# Altium project USBC_Power_Supply.PrjPcb (part 1 of 2)
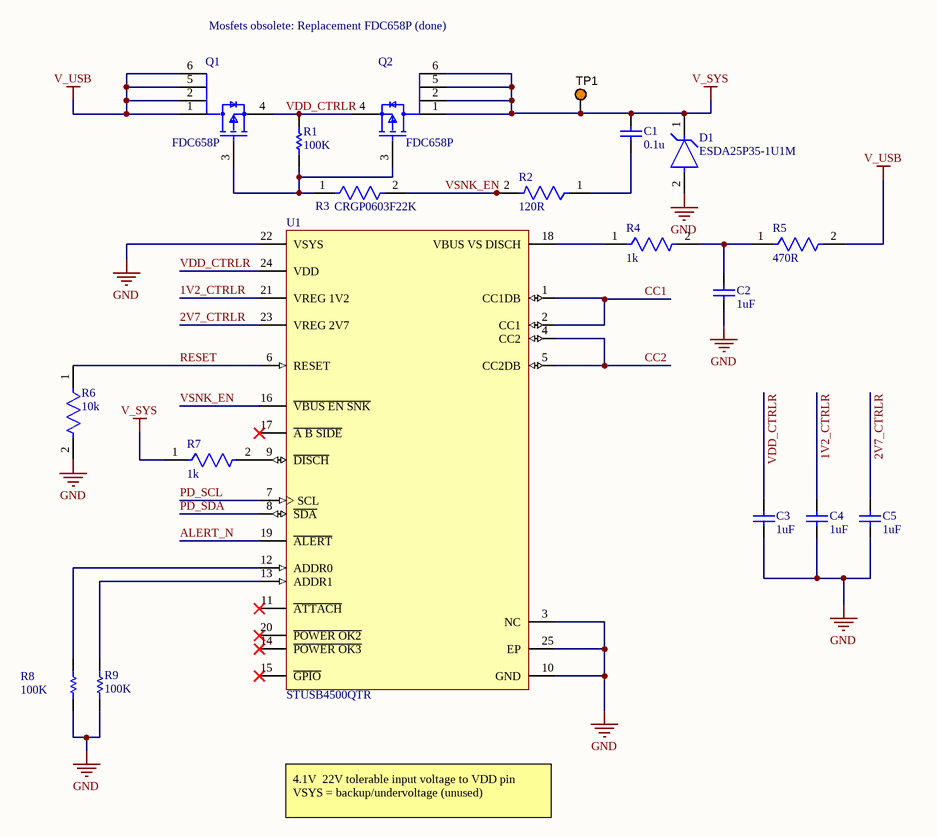
[diagram p0: USBC_PD_Controller.SchDoc]
8 sheets, 169 parts. Net scope: global (net labels, ports and power ports of the same name join across sheets).
Board file: USBC_PD_Development_PCB.PcbDoc
Sheets:
  USBC_PD_Controller.SchDoc
  USB_C_Connectors.SchDoc
  MCU.SchDoc
  Positive_Output.SchDoc
  Negative_Output.SchDoc
  Logic_Level_Output.SchDoc
  External_Connectors.SchDoc
  Measurements.SchDoc

## Sheet USBC_PD_Controller.SchDoc
size A; SheetNumber: 1; SheetTotal: 8

### Parts
C1  0.1u  [CAPC2013X140X50ML20T25]
C2  1uF  [CAPC2013X145X50NL20T20]
C3  1uF  [CAPC2013X145X50NL20T20]
C4  1uF  [CAPC2013X145X50NL20T20]
C5  1uF  [CAPC2013X145X50NL20T20]
D1  ESDA25P35-1U1M  [FP-QFN_1610-MFG]
Q1  FDC658P  [FP-419BL-MFG]
Q2  FDC658P  [FP-419BL-MFG]
R1  100K  [RESC0603(1608)_N]
R2  120R  [FP-SR0603-MFG]
R3  CRGP0603F22K  [FP-CRGP0603-IPC_C]
R4  1k  [FP-MCT0603-IPC_C]
R5  470R  [FP-CRCW0603-HPe3-MFG]
R6  10k  [FP-CRCW0603-e3-IPC_A]
R7  1k  [FP-MCT0603-IPC_C]
R8  100K  [RESC0603(1608)_N]
R9  100K  [RESC0603(1608)_N]
TP1  5003  [KSTN-5003]  (value not drawn)
U1  STUSB4500QTR  [FP-QFN-24-EP_4x4-MFG]

### Nets
GND: C2.2 C3.2 C4.2 C5.2 D1.2(A) R6.2 R8.1 R9.1 U1.3(NC) U1.10(GND) U1.22(VSYS) U1.25(EP)
V_SYS: C1.1 D1.1(C) Q2.1(D) Q2.2(D) Q2.5(D) Q2.6(D) R7.1 TP1.1
V_USB: Q1.1(D) Q1.2(D) Q1.5(D) Q1.6(D) R5.2
1V2_CTRLR: C4.1 U1.21(VREG_1V2)
2V7_CTRLR: C5.1 U1.23(VREG_2V7)
ALERT_N: U1.19(~{ALERT})
CC1: U1.1(CC1DB) U1.2(CC1)
CC2: U1.4(CC2) U1.5(CC2DB)
PD_SCL: U1.7(SCL)
PD_SDA: U1.8(~{SDA})
RESET: R6.1 U1.6(RESET)
VDD_CTRLR: C3.1 Q1.4(S) Q2.4(S) R1.2 U1.24(VDD)
VSNK_EN: R2.2 R3.2 U1.16(~{VBUS_EN_SNK})
NetC1_2: C1.2 R2.1
NetC2_1: C2.1 R4.2 R5.1
NetQ1_3: Q1.3(G) Q2.3(G) R1.1 R3.1
NetR4_1: R4.1 U1.18(VBUS_VS_DISCH)
NetR7_2: R7.2 U1.9(~{DISCH})
NetR8_2: R8.2 U1.12(ADDR0)
NetR9_2: R9.2 U1.13(ADDR1)

Not connected (* = marked no-connect by the designer): U1 11(~{ATTACH})* 14(~{POWER_OK3})* 15(~{GPIO})* 17(~{A_B_SIDE})* 20(~{POWER_OK2})*

### Notes on the sheet
- Mosfets obsolete: Replacement FDC658P (done)
- 4.1V  22V tolerable input voltage to VDD pin
  VSYS = backup/undervoltage (unused)

### Library data of the parts
C1 = CMP-2007-04651-1: Part Number: 0805DD104KAT2A; Manufacturer: AVX Interconnect / Elco
C2-C5 = CMP-2007-01676-1: Part Number: VJ0805Y105KXQRW1BC; Manufacturer: Vitramon
D1 = CMP-12225-000030-1: TVS DIODE 22V 41V 1610; Manufacturer: STMicroelectronics; Clamping Voltage: 39V; Breakdown Voltage: 23.3V; Max Junction Temp: +150°C; Peak Pulse Current: 35A; Number Of Channels: 1; Peak Pulse Power: 1400W; Standoff Height: 0.02mm; Direction: Unidirectional; ComponentLink2URL: https://www.st.com/resource/en/datasheet/esda25p35-1u1m.pdf; Height: 0.6mm; Device Class L2: TVS Diodes; Temperature: -55°C to +150°C; Category: Diode; Temperature Range Low: -55°C; Digikey Description: TVS DIODE 22V 41V 1610; Reverse Standoff Voltage: 22V; Lead Free: Yes; Automotive: No; RoHS: TRUE; Manufacturer Part Number: ESDA25P35-1U1M; Temperature Range High: +150°C; Package: QFN_1610; Device Class L1: Circuit Protection; Device Class L3: unset; ComponentLink2Description: Datasheet; Octopart: https://octopart.com/esda25p35-1u1m-stmicroelectronics-75302699; Mouser Description: ESDA Series 1400 W 25 V Uni-Directional Surface Mount TVS Diode - QFN-1610
Q1 Q2 = CMP-07173-000014-1: MOSFET P-CH 30V 4A SSOT-6; Manufacturer: ON Semiconductor; Pulse Drain Current: -20A; Drain To Source Breakdown Voltage: -30V; Continuous Drain Current: -4A; Turn On Delay Time: 12ns; Input Capacitace At Vds: 750pF @ -15V; Max Forward Diode Voltage: -1.2V; Depletion Mode: False; Number Of Channels: 1; Standoff Height: 0mm; Typ Forward Diode Voltage: -0.76V; Drain To Source Resistance: 0.041Ω; Power Dissipation: 0.8W; Rthja Max: 78°C/W; Turn Off Delay Time: 24ns; Threshold Vgs Max: -3V; Transconductance: 9S; Max Junction Temp: +150°C; Threshold Vgs Min: -1V; Gate To Source Voltage: 20V; Gate Charge At Vgs: 8nC @ -5V; Temperature Range Low: -55°C; Temperature: -55°C to +150°C; Octopart: https://octopart.com/fdc658p-on+semiconductor-84325768; Lead Free: Yes; Drain To Source Voltage: -30V; Device Class L1: Discrete Semiconductors; Manufacturer Part Number: FDC658P; Package: 419BL; ComponentLink2URL: https://www.onsemi.com/pub/Collateral/FDC658P-D.PDF; Height: 1.1mm; Mouser Description: MOSFET SSOT-6 P-CH -30V; Digikey Description: MOSFET P-CH 30V 4A SSOT-6; RoHS: TRUE; Temperature Range High: +150°C; Device Class L2: Transistors; Automotive: No; Device Class L3: MOSFETs; Footprint Url: https://www.onsemi.com/pub/Collateral/419BL.PDF; Number Of P Channels: 1; ComponentLink2Description: Datasheet; Category: Trans
R1 R8 R9 = CMP-1012-00736-1: 100K 0.1W 1% 0603 (1608 Metric)  SMD; Value: 100000.00 Ohm; Case-Metric: 1608; Case-EIA: 0603; Power: 0.1 W; Tolerance: 1 %; Technology: SMT
R2 = CMP-03412-000681-1: RES SMD 0603 1/4W 1% 120 OHM; Manufacturer: Yageo; Manufacturer Part Number: SR0603FR-7T120RL; Automotive Grade: Grade 0; Voltage Rating: 75V; Value: 120Ω; Power Rating: 0.25W; Tolerance: 0.01; Octopart: https://octopart.com/sr0603fr-7t120rl-yageo-92673849; Lead Free: Yes; Ipc Land Pattern Name: RESC16080X45; ComponentLink2URL: http://www.yageo.com/documents/recent/PYu-SR_D_F%20tol_RoHS_L_3.pdf; RoHS: TRUE; Category: Res; Digikey Description: RES SMD 0603 1/4W 1% 120 OHM; Footprint Url: http://www.yageo.com/exep/pages/download/literatures/PYu-R_Mount_10.pdf; ComponentLink2Description: Datasheet; Temperature Range High: +155°C; Device Class L3: Chip SMD Resistors; Mouser Description: Surge Chip Resistor Automotive Grade Thick Film 0603 120Ohm 1% Paper T/R; Resistance: 120Ω; Height: 0.55mm; Temperature Range Low: -55°C; Automotive: Yes; Temperature: -55°C to +155°C; Device Class L1: Passive Components; Package: SR0603; Series: SR; Device Class L2: Resistors; Composition: Thick Film
R3 = CMP-03211-006681-1: CRGP 0603 22K 1%; Manufacturer: TE; Resistance: 22KΩ; Power Rating: 0.25W; Temperature Coefficient: ±100ppm/°C; Tolerance: 0.01; Voltage Rating: 50V; Value: 22KΩ; Lead Free: Yes; Device Class L3: Chip SMD Resistors; Ipc Land Pattern Name: RESC16080X45; Composition: Thick Film; Octopart: https://octopart.com/crgp0603f22k-te+connectivity-91018742; RoHS: TRUE; ComponentLink2Description: Datasheet; Digikey Description: CRGP 0603 22K 1%; Category: Res; Temperature: -55°C to +155°C; Manufacturer Part Number: CRGP0603F22K; Temperature Range High: +155°C; Series: CRGP; ComponentLink2URL: https://www.te.com/commerce/DocumentDelivery/DDEController?Action=srchrtrv&DocNm=9-1773463-9&DocType=DS&DocLang=English; Device Class L2: Resistors; Height: 0.55mm; Ambient Temperature Range High: +70°C; Device Class L1: Passive Components; Automotive: No; Temperature Range Low: -55°C; Package: CRGP0603
R4 R7 = CMP-02407-000843-1: RES SMD 100 OHM 1% 1/8W 0603; Resistance: 1kR; Max Power Dissipation: 125mW; Tolerance: 0.1%; Temperature Coefficient: 25ppm/°C; Height: 0.022inch; Packaging: Tape and Reel; Composition: Thin Film; Number of Terminations: 2; Length: 0.061inch; Width: 0.033inch; Case/Package: 0603
R5 = CMP-02407-009460-1: RES Thick Film, 470Ω, 5%, 0.33W, 200ppm/°C, 0603; Max Power Dissipation: 250mW; Voltage Rating: 75V; Case/Package: 0603; Lead Free: Lead Free; Min Operating Temperature: -55°C; Features: Automotive AEC-Q200; Temperature Coefficient: 200ppm/°C; Max Operating Temperature: 155°C; Number of Terminations: 2; Width: 0.8mm; Weight: 7.1E-05oz; Case Code (Imperial): 0603; Radiation Hardening: No; Tolerance: 5%; Termination: SMD/SMT; Contact Plating: Tin; Case Code (Metric): 1608; Packaging: Tape and Reel; Package Quantity: 5000; Resistance: 470R; Length: 0.063inch; Composition: Thick Film; Power Rating: 250mW; Height: 0.022inch
R6 = CMP-02407-003273-1: RES Thick Film, 10kΩ, 1%, 0.1W, 100ppm/°C, 0603; Max Power Dissipation: 100mW; Resistance: 10kR; Tolerance: 1%; Packaging: Tape and Reel; Lead Free: Lead Free; Max Operating Temperature: 155°C; Min Operating Temperature: -55°C; Package Quantity: 10000; Length: 0.061inch; Height: 0.02inch; Width: 0.033inch; Composition: Thick Film; Number of Terminations: 2; Case/Package: 0603; Features: Automotive AEC-Q200; Temperature Coefficient: 100ppm/°C
TP1 = CMP-1672-00009-1: Test Point, Orange, 1-Pin THD, RoHS; Peak Reverse Current: 600 uA; Forward Current: 3 A; Max Surge Current: 80 A; Forward Voltage: 1.08 V; Max Operating Temperature: 150 degC; PackageReference: 5003; Pins: 2; ComponentLink2URL: http://keyelco.com/userAssets/file/M65p56.pdf; PackageDescription: 1-Pin Through Hole Device, Dia 2.54 mm; Weight: 0.01 lb; Diameter: 5.3 mm; Mount: Through Hole; Package Quantity: 500; Packaging: Bulk; Min Operating Temperature: -65 degC; ComponentLink1Description: Manufacturer URL; Height: 0.25 inch; ComponentLink1URL: http://www.keyelco.com/; ComponentLink2Description: Datasheet; Width: 0.25 inch; REACH SVHC: No SVHC; RoHSCompliant: true; Radiation Hardening: No; Length: 9.5 mm; DatasheetVersion: Jun-15
U1 = CMP-12113-000003-3: 4.1V~22V USB 2.0 I2C Controllers Interface ICs STUSB45 Controller 24-VFQFN Exposed Pad; Number of Ports: 1; Min Supply Voltage: 3V; Max Junction Temperature (Tj): 145°C; Max Supply Voltage: 22V; Interface: I2C, USB; USB Standard: USB 2.0; Lifecycle Status: Production; Schedule B: 8542390000, 8542390000; Min Operating Temperature: -40°C; Ambient Temperature Range High: 105°C; Max Operating Temperature: 105°C; Height: 1mm

## Sheet USB_C_Connectors.SchDoc
size A; SheetNumber: 2; SheetTotal: 8
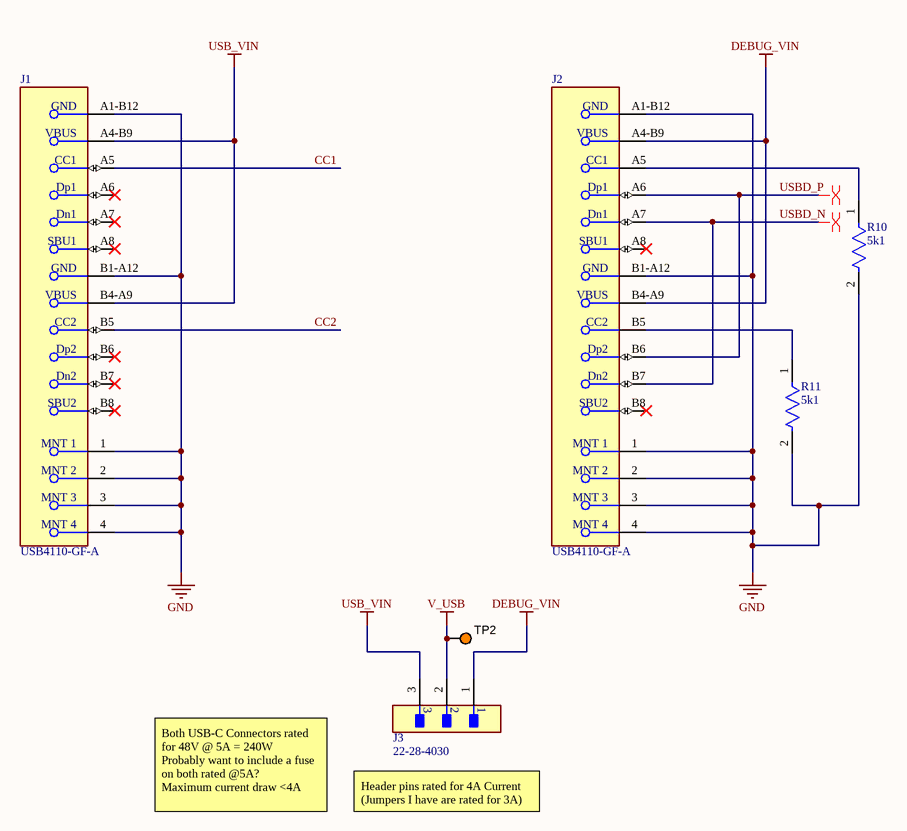
[diagram p1: USB_C_Connectors.SchDoc]

### Parts
J1  USB4110-GF-A  [FP-USB4110-GF-A-MFG]
J2  USB4110-GF-A  [FP-USB4110-GF-A-MFG]
J3  22-28-4030  [FP-22-28-4030-MFG]
R10  5k1  [FP-CRCW0603-C-MFG]
R11  5k1  [FP-CRCW0603-C-MFG]
TP2  5003  [KSTN-5003]  (value not drawn)

### Nets
DEBUG_VIN: J2.A4-B9(VBUS) J2.B4-A9(VBUS) J3.1
GND: J1.1(MNT_1) J1.2(MNT_2) J1.3(MNT_3) J1.4(MNT_4) J1.A1-B12(GND) J1.B1-A12(GND) J2.1(MNT_1) J2.2(MNT_2) J2.3(MNT_3) J2.4(MNT_4) J2.A1-B12(GND) J2.B1-A12(GND) R10.2 R11.2
USB_VIN: J1.A4-B9(VBUS) J1.B4-A9(VBUS) J3.3
V_USB: J3.2 TP2.1
CC1: J1.A5(CC1)
CC2: J1.B5(CC2)
USBD_N: J2.A7(Dn1) J2.B7(Dn2)
USBD_P: J2.A6(Dp1) J2.B6(Dp2)
NetJ2_A5: J2.A5(CC1) R10.1
NetJ2_B5: J2.B5(CC2) R11.1

Not connected (* = marked no-connect by the designer): J1 A6(Dp1)* A7(Dn1)* A8(SBU1)* B6(Dp2)* B7(Dn2)* B8(SBU2)*; J2 A8(SBU1)* B8(SBU2)*

### Layout directives
differential pair: USBD_N, USBD_P

### Notes on the sheet
- Both USB-C Connectors rated for 48V @ 5A = 240W
  Probably want to include a fuse on both rated @5A?
  Maximum current draw <4A
- Header pins rated for 4A Current
  (Jumpers I have are rated for 3A)

### Library data of the parts
J1 J2 = CMP-245163-000002-1: CONN USB 2.0 TYPE-C R/A SMT; Manufacturer: GCT; Conn Orientation: Right Angle; Usb Standard: USB 2.0; Voltage Rating: 20V; Current Rating: 3/4.25/1.25/0.25A; Number Of Contacts: 16; Is Female: yes; Shielding: true; Standoff Height: 0.1mm; Octopart: https://octopart.com/usb4110-gf-a-gct-103941985; Temperature: -40°C to +85°C; RoHS: TRUE; Automotive: No; Contact Material: Gold,Nickel; Device Class L1: Connectors; Device Class L2: USB Connectors; Package: 0; Lead Free: Yes; ComponentLink2URL: https://gct.co/files/drawings/usb4110.pdf; Temperature Range High: +85°C; Temperature Range Low: -40°C; Height: 3.46mm; Manufacturer Part Number: USB4110-GF-A; ComponentLink2Description: Datasheet; Device Class L3: unset; Digikey Description: CONN USB 2.0 TYPE-C R/A SMT; Category: Conn
J3 = CMP-04776-000098-1: CONN HEADER VERT 3POS 2.54MM; Manufacturer: Molex; Conn Orientation: Vertical; Conn Gender: Male; Current Rating: 4A; Voltage Rating: 500V; Number Of Contacts: 3; Category: Conn; Number Of Rows: 1; Manufacturer Part Number: 22-28-4030; RoHS: TRUE; Package: 22-28-4030; Footprint Url: https://www.molex.com/pdm_docs/sd/022284030_sd.pdf; ComponentLink2Description: Datasheet; Device Class L2: Headers and Wire Housings; Automotive: No; Temperature Range Low: -40°C; Digikey Description: CONN HEADER VERT 3POS 2.54MM; Mouser Description: Headers & Wire Housings 3P VERT HEADER Sn; Contact Material: Gold,Nickel; Pitch: 2.54mm; Device Class L1: Connectors; Lead Free: Yes; Device Class L3: unset; Temperature Range High: +80°C; Octopart: https://octopart.com/0022284030-molex-10476094; ComponentLink2URL: https://www.molex.com/webdocs/datasheets/pdf/en-us/0022284030_PCB_HEADERS.pdf; Height: 8.88mm; Temperature: -40°C to +80°C
R10 R11 = CMP-02407-012453-1: RES 5.1K OHM 5% 1/10W 0603; Power Rating: 100mW; Resistance: 5.1kR; Temperature Coefficient: 200ppm/°C; Contact Plating: Tin; Resistor Type: Thick Film; RoHS Compliant: Yes; Mount: Surface Mount; Tolerance: 5%; Lead Free: Lead Free; Min Operating Temperature: -55°C; Max Operating Temperature: 155°C; Termination: Wraparound; Length: 1.55mm; Case/Package: SMD/SMT
TP2 = CMP-1672-00009-1: as TP1 on sheet USBC_PD_Controller; Max Operating Temperature: 150 degC; PackageReference: 5003; Pins: 2; ComponentLink2URL: http://keyelco.com/userAssets/file/M65p56.pdf; PackageDescription: 1-Pin Through Hole Device, Dia 2.54 mm; Weight: 0.01 lb; Diameter: 5.3 mm; Mount: Through Hole; Package Quantity: 500; Packaging: Bulk; Min Operating Temperature: -65 degC; ComponentLink1Description: Manufacturer URL; Height: 0.25 inch; ComponentLink1URL: http://www.keyelco.com/; ComponentLink2Description: Datasheet; Width: 0.25 inch; REACH SVHC: No SVHC; RoHSCompliant: true; Radiation Hardening: No; Length: 9.5 mm; DatasheetVersion: Jun-15

## Sheet MCU.SchDoc
size A; SheetNumber: 3; SheetTotal: 8
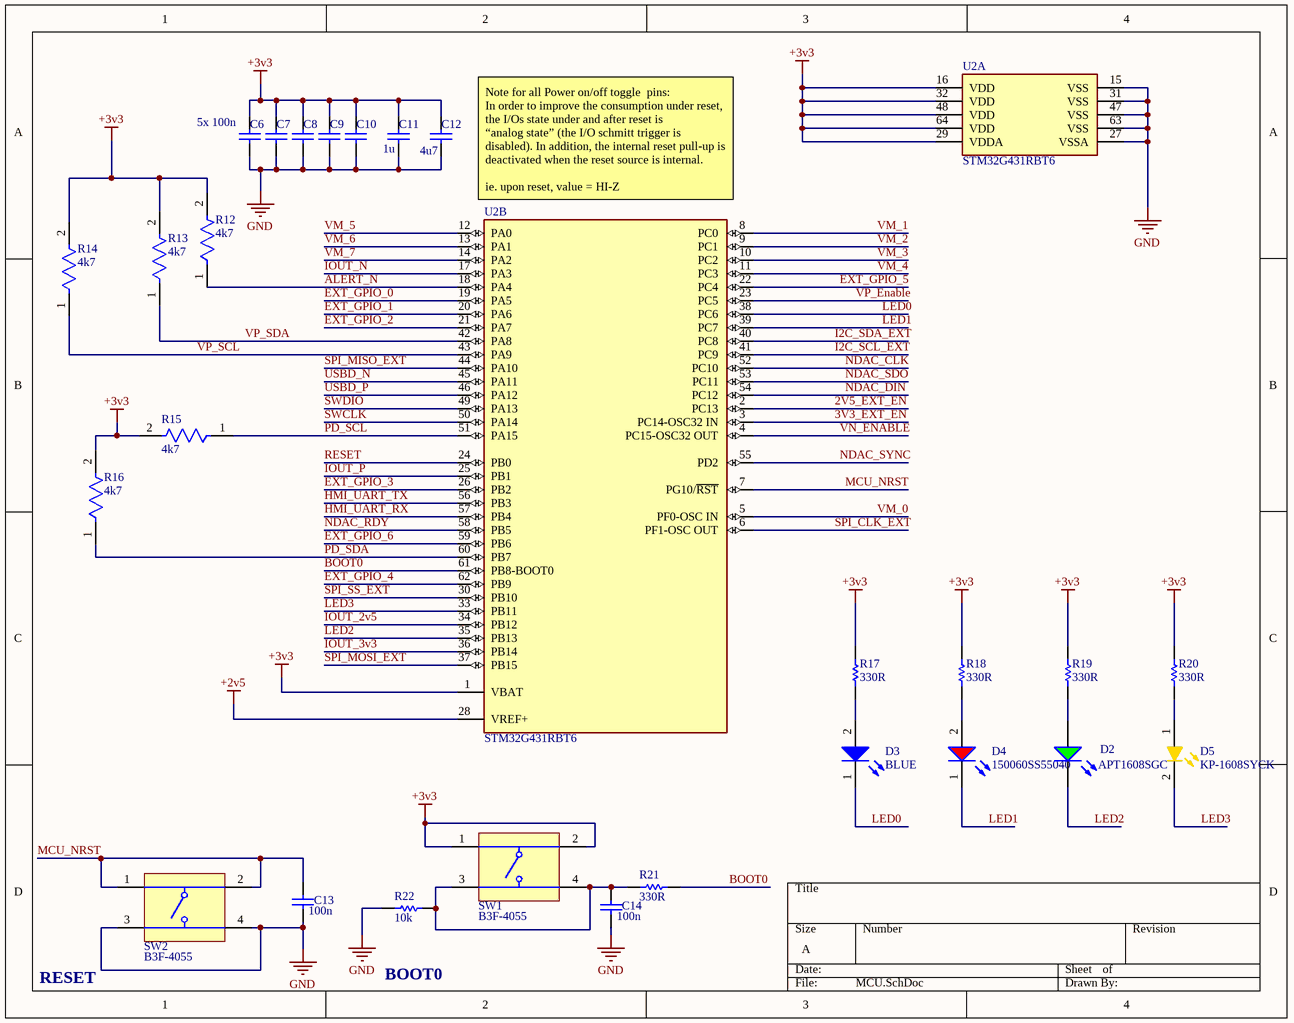
[diagram p2: MCU.SchDoc]

### Parts
C6  100n 0805  [CAPC2013X145X50NL20T25]  (value not drawn)
C7  100n 0805  [CAPC2013X145X50NL20T25]  (value not drawn)
C8  100n 0805  [CAPC2013X145X50NL20T25]  (value not drawn)
C9  100n 0805  [CAPC2013X145X50NL20T25]  (value not drawn)
C10  100n 0805  [CAPC2013X145X50NL20T25]  (value not drawn)
C11  1u  [CAPC2013X145X50NL20T25]
C12  4u7  [CAPC2013X145X50NL20T25]
C13  100n  [CAPC2013X145X50NL20T25]
C14  100n  [CAPC2013X145X50NL20T25]
D2  APT1608SGC  [KING-APT1608SGC_V]
D3  BLUE  [WL-SMCW_0603_150060xx75000]
D4  150060SS55040  [WL-SMCD_0603]
D5  KP-1608SYCK  [KING-0603LED_YELLOW_V]
R12  4k7  [FP-AC0603-IPC_A]
R13  4k7  [FP-AC0603-IPC_A]
R14  4k7  [FP-AC0603-IPC_A]
R15  4k7  [FP-AC0603-IPC_A]
R16  4k7  [FP-AC0603-IPC_A]
R17  330R  [RESC1608X55X25NL10T15]
R18  330R  [RESC1608X55X25NL10T15]
R19  330R  [RESC1608X55X25NL10T15]
R20  330R  [RESC1608X55X25NL10T15]
R21  330R  [RESC1608X55X30NL15T15]
R22  10k  [RESC1608X55X30NL15T15]
SW1  B3F-4055  [OMRON-B3F-4055_V]
SW2  B3F-4055  [OMRON-B3F-4055_V]
U2  STM32G431RBT6  [FP-LQFP64-5W-MFG]  (parts A,B of 2)

### Nets
+2v5: U2.28(VREF+)
+3v3: C6.2 C7.2 C8.2 C9.2 C10.2 C11.2 C12.2 R12.2 R13.2 R14.2 R15.2 R16.2 R17.2 R18.2 R19.2 R20.2 SW1.1 SW1.2 U2.1(VBAT) U2.16(VDD) U2.29(VDDA) U2.32(VDD) U2.48(VDD) U2.64(VDD)
GND: C6.1 C7.1 C8.1 C9.1 C10.1 C11.1 C12.1 C13.1 C14.1 R22.1 SW2.3 SW2.4 U2.15(VSS) U2.27(VSSA) U2.31(VSS) U2.47(VSS) U2.63(VSS)
2V5_EXT_EN: U2.2(PC13)
3V3_EXT_EN: U2.3(PC14-OSC32_IN)
ALERT_N: R12.1 U2.18(PA4)
BOOT0: R21.2 U2.61(PB8-BOOT0)
EXT_GPIO_0: U2.19(PA5)
EXT_GPIO_1: U2.20(PA6)
EXT_GPIO_2: U2.21(PA7)
EXT_GPIO_3: U2.26(PB2)
EXT_GPIO_4: U2.62(PB9)
EXT_GPIO_5: U2.22(PC4)
EXT_GPIO_6: U2.59(PB6)
HMI_UART_RX: U2.57(PB4)
HMI_UART_TX: U2.56(PB3)
I2C_SCL_EXT: U2.41(PC9)
I2C_SDA_EXT: U2.40(PC8)
IOUT_2v5: U2.34(PB12)
IOUT_3v3: U2.36(PB14)
IOUT_N: U2.17(PA3)
IOUT_P: U2.25(PB1)
LED0: D3.1(K) U2.38(PC6)
LED1: D4.1(K) U2.39(PC7)
LED2: D2.2(K) U2.35(PB13)
LED3: D5.2(K) U2.33(PB11)
MCU_NRST: C13.2 SW2.1 SW2.2 U2.7(PG10/~{RST})
NDAC_CLK: U2.52(PC10)
NDAC_DIN: U2.54(PC12)
NDAC_RDY: U2.58(PB5)
NDAC_SDO: U2.53(PC11)
NDAC_SYNC: U2.55(PD2)
PD_SCL: R15.1 U2.51(PA15)
PD_SDA: R16.1 U2.60(PB7)
RESET: U2.24(PB0)
SPI_CLK_EXT: U2.6(PF1-OSC_OUT)
SPI_MISO_EXT: U2.44(PA10)
SPI_MOSI_EXT: U2.37(PB15)
SPI_SS_EXT: U2.30(PB10)
SWCLK: U2.50(PA14)
SWDIO: U2.49(PA13)
USBD_N: U2.45(PA11)
USBD_P: U2.46(PA12)
VM_0: U2.5(PF0-OSC_IN)
VM_1: U2.8(PC0)
VM_2: U2.9(PC1)
VM_3: U2.10(PC2)
VM_4: U2.11(PC3)
VM_5: U2.12(PA0)
VM_6: U2.13(PA1)
VM_7: U2.14(PA2)
VN_ENABLE: U2.4(PC15-OSC32_OUT)
VP_Enable: U2.23(PC5)
VP_SCL: R14.1 U2.43(PA9)
VP_SDA: R13.1 U2.42(PA8)
NetC14_2: C14.2 R21.1 R22.2 SW1.3 SW1.4
NetD2_1: D2.1(A) R19.1
NetD3_2: D3.2(A) R17.1
NetD4_2: D4.2(A) R18.1
NetD5_1: D5.1(A) R20.1

### Notes on the sheet
- (near C6) 5x 100n
- Note for all Power on/off toggle  pins:
  In order to improve the consumption under reset, the I/Os state under and after reset is
  “analog state” (the I/O schmitt trigger is disabled). In addition, the internal reset pull-up is
  deactivated when the reset source is internal.
  ie. upon reset, value = HI-Z
- RESET
- BOOT0

### Library data of the parts
C6-C14 = CMP-2007-01213-1: Part Number: C0805C106M9RACTU; Manufacturer: Kemet
D2 = CMP-2000-05789-1: Super Bright Green LED, 62.5 mW, 25 mA, -40 to 85 degC, 2-Pin SMD, RoHS, Tape and Reel; Manufacturer: Kingbright; Online Catalog: 0603RectanglewithFlatTopChipLEDs; Wavelength - Dominant: 568nm; Wavelength - Peak: 565nm; Voltage - Forward (Vf) (Typ): 2.2V; Lens Type: Clear; Other Names: 754-1121-2; Millicandela Rating: 15mcd; Catalog Drawings: APT1608SeriesTop / APT1608SeriesSide; Lens Style/Size: RectanglewithFlatTop,1.2mmx0.8mm; Current - Test: 20mA; 3D Model: APT1608x.sldprt / APT1608x.pro / APT1608x.igs / APT1608x.stp; Viewing Angle: 120°; Package / Case: 0603(1608Metric); Category: Optoelectronics; Package Description: 2-Pin Surface Mount Device, Body 0.8 x 1.6 mm; Mounting Type: SurfaceMount; Color: Green; Height: 0.75mm; Datasheet Version: Rev. 16B, 02/2012; Family: LEDIndication-Discrete; Manufacturer URL: http://www.kingbright.com/; Package Reference: APT1608SGC; Datasheet URL: https://datasheet.ciiva.com/2113/apt1608sgc-2113808.pdf; Mounting Technology: SurfaceMount; Packaging: Tape&Reel(TR); Standard Package: 2,000; Size / Dimension: 1.60mmLx0.80mmW
D3 = CMP-1426-00003-4: Led, Blue, 470 Nm, 3.2 V, 30 Ma, 145 Mcd Rohs Compliant: Yes; Peak Wavelength: 465nm; Dominant Wavelength: 470nm; Power Dissipation: 105mW; Viewing Angle: 140°; Test Current: 20mA; Max Junction Temperature (Tj): 95°C; Forward Current: 100mA; Reverse Voltage: 5V; Luminous Intensity: 145mcd; Lens Style: Clear, Rectangular; Forward Voltage: 3.2V; RoHS: Compliant; Min Operating Temperature: -40°C; REACH SVHC: Unknown; Max Operating Temperature: 85°C; Width: 800µm; Case Code (Imperial): 0603; Case Code (Metric): 1608; Max Reverse Voltage (DC): 5V; Height: 700µm; Case/Package: 0603; Mount: Surface Mount; Packaging: Tape and Reel; Color: Blue; Wavelength: 470nm; Length: 1.6mm
D4 = CMP-03913-90235567-2: 150060SS55040 WL-SMCD SMT Mono-color Chip LED Diffused; Max Reverse Voltage (DC): 5V; Luminous Intensity: 70mcd; Forward Current: 40mA; Wavelength: 630nm; Peak Wavelength: 645nm; Viewing Angle: 140°; Forward Voltage: 2V; Packaging: Tape and Reel; Length: 1.6mm; Height: 400µm; Min Operating Temperature: -40°C; NexarPartId: 90235567; Dominant Wavelength: 630nm; Width: 800µm; Max Operating Temperature: 85°C; RoHS: Compliant
D5 = CMP-0404-00003-1: LED, SMT, 0603(1608), 1.1mm thickness, Yellow; Manufacturer: Kingbright; Reverse Voltage: 5 V; Packing Type: 2000 pcs / reel; Forward Current: 30 mA; Power Dissipation: 75 mW; ComponentLink2URL: http://www.kingbright.com/manager/upload/pdf/(1366274739)KP-1608SYCK(Ver.18B).pdf; PartNumber: KP-1608SYCK; ComponentLink1URL: http://www.kingbright.com/; ComponentLink2Description: Datasheet; PackageDescription: 2-Pin SMT LED, 1.6 x 0.8 mm Pitch; PackageReference: 0603LED_YELLOW; ComponentLink1Description: Manufacturer URL; Storage Temperature: -40 to +85 degC; Mounting Technology: Surface Mount
R12-R16 = CMP-03412-006483-2: RES 4.7KΩ 1.00% 0.1W 0603; Tolerance: 1%; Resistance: 4.7kR; Case/Package: 0603; RoHS Compliant: Yes
R17-R20 = CMP-1659-00020-2: Chip Resistor, 330 Ohm, +/- 1%, 0.1 W, -55 to 155 degC, 0603 (1608 Metric), RoHS, Tape and Reel; Tolerance: 10%; ESR: 800 mohm; Voltage Rating (DC): 16 V; Capacitance: 47 uF; Length: 7.3 mm; ComponentLink1URL: http://www.yageo.com/; Packaging: Tape and Reel; Pins: 2; ComponentLink1Description: Manufacturer URL; Case Code (Imperial): 2917; REACH SVHC: No SVHC; Width: 4.3 mm; ComponentLink2Description: Datasheet; Voltage Rating: 16 V; RoHSCompliant: True; Max Operating Temperature: 125degC; ComponentLink2URL: http://www.yageo.com/documents/recent/PYu-RC_Group_51_RoHS_L_04.pdf; Min Operating Temperature: -55degC; Case/Package: 2917; Radiation Hardening: No; DatasheetVersion: Rev. 4, 02/2016; Mount: Surface Mount; PackageReference: 0603; Package Quantity: 500; Case Code (Metric): 7343; PackageDescription: 2-Pin Surface Mount Device, Body 1.6 x 0.8 mm; Height: 3.1 mm
R21 R22 = CMP-2000-00258-1: Part Number: ERJ-3EKF1502V; Manufacturer: Panasonic
SW1 SW2 = CMP-2000-05902-1: Tactile Switch, 1 to 50 mA, 100 mOhm Max, 5 to 24 VDC, -25 to 70 degC, 4-Pin THD, RoHS, Bulk; Manufacturer: OmronElectronics; Contact Rating @ Voltage: 0.05@24VDCA; Pole Throw Configuration: SPST; Dielectric Strength: 500VAC; Maximum DC Voltage Rating: 24V; Electrical Life: 1000000Cycles; Product Weight: 0.85g; Switch Configuration: N.O.; Actuator Style: ProjectedPlunger; Actuator Color: Orange; Actuator Length: 3mm; Illumination Type: N/R; Body Orientation: Straight; Operating Force: 2.55N; Ground Terminal: No; Datasheet URL: https://datasheet.ciiva.com/20148/78-0136-20148640.pdf; Seal Location: N/A; Mechanical Life: N/A; Operating Temperature: -25to70C; Maximum AC Voltage Rating: N/A; Dimension: 12x12x7.3mm; Minimum Insulation Resistance: 100MOhm; Mounting: ThroughHole,PCPins; Housing Material: N/A; Packaging: Bag; Part No: B3F-4055; Maximum Contact Resistance: 100mOhm; Base Material: N/A; Manufacturer URL: http://www.omron.com/; RoHS: Yes; Contact Material: N/A; Package Description: 4-Pin Through Hole Device, Body 12 x 12 mm; Family: B3F; Mounting Technology: ThroughHole; Package Reference: B3F-4055; Contact Plating: Gold; Seal Description: N/A; Type: Miniature; Datasheet Version: 06/2009
U2 = CMP-12105-000150-1: IC MCU 32BIT 128KB FLASH 64LQFP; RoHS Compliant: Yes

## Sheet Positive_Output.SchDoc
size A; SheetNumber: 4; SheetTotal: 8
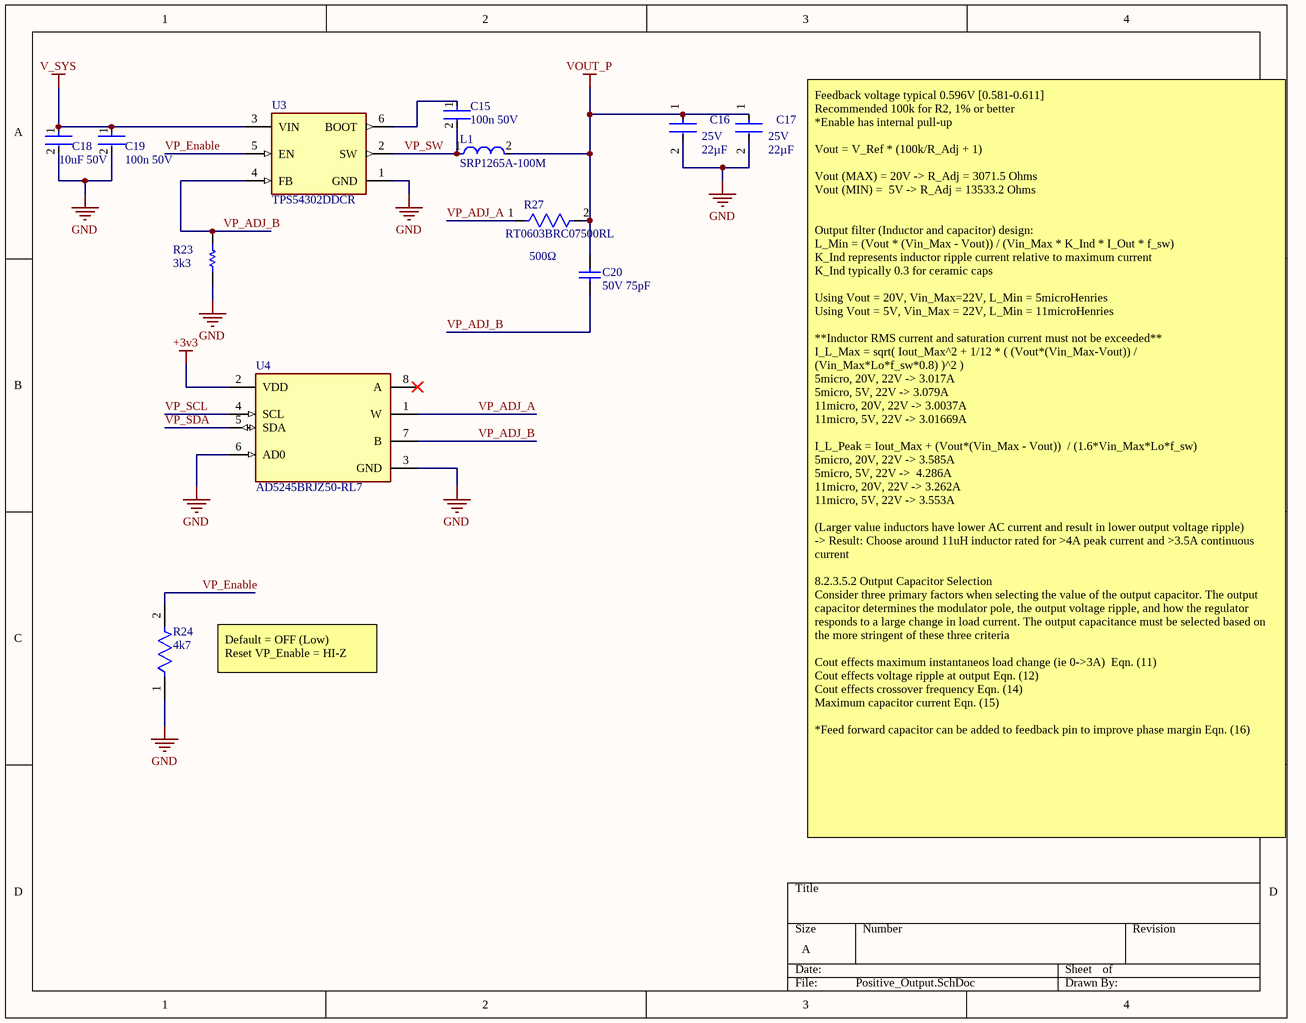
[diagram p3: Positive_Output.SchDoc]

### Parts
C15  100n 50V  [FP-C0603C-CF-MFG]
C16  CL31A226KAHNNNE  [CL31H-0_2_MFG]  (value not drawn)
C17  CL31A226KAHNNNE  [CL31H-0_2_MFG]  (value not drawn)
C18  10uF 50V  [FP-CL31-IPC_C]
C19  100n 50V  [FP-C0603C-CF-MFG]
C20  50V 75pF  [CAPC1608X90X35ML15T15]
L1  SRP1265A-100M  [FP-SRP1265A-100M-MFG]
R23  3k3  [RESC0603(1608)_N]
R24  4k7  [FP-AC0603-IPC_A]
R27  RT0603BRC07500RL  [RESC16080X45_RT0603-0_55_MFG]
U3  TPS54302DDCR  [FP-DDC0006A-MFG]
U4  AD5245BRJZ50-RL7  [FP-RJ-8-IPC_A]

### Nets
+3v3: U4.2(VDD)
GND: C16.2 C17.2 C18.2 C19.2 R23.1 R24.1 U3.1(GND) U4.3(GND) U4.6(AD0)
V_SYS: C18.1 C19.1 U3.3(VIN)
VOUT_P: C16.1 C17.1 C20.2 L1.2 R27.2
VP_ADJ_A: R27.1 U4.1(W)
VP_ADJ_B: C20.1 R23.2 U3.4(FB) U4.7(B)
VP_Enable: R24.2 U3.5(EN)
VP_SCL: U4.4(SCL)
VP_SDA: U4.5(SDA)
VP_SW: C15.2 L1.1 U3.2(SW)
NetC15_1: C15.1 U3.6(BOOT)

Not connected (* = marked no-connect by the designer): U4 8(A)*

### Notes on the sheet
- (near R24) Default = OFF (Low)
  Reset VP_Enable = HI-Z
- Feedback voltage typical 0.596V [0.581-0.611]
  Recommended 100k for R2, 1% or better
  *Enable has internal pull-up
  Vout = V_Ref * (100k/R_Adj + 1)
  Vout (MAX) = 20V -> R_Adj = 3071.5 Ohms
  Vout (MIN) =  5V -> R_Adj = 13533.2 Ohms
  Output filter (Inductor and capacitor) design:
  L_Min = (Vout * (Vin_Max - Vout)) / (Vin_Max * K_Ind * I_Out * f_sw)
  K_Ind represents inductor ripple current relative to maximum current
  K_Ind typically 0.3 for ceramic caps
  Using Vout = 20V, Vin_Max=22V, L_Min = 5microHenries
  Using Vout = 5V, Vin_Max = 22V, L_Min = 11microHenries
  **Inductor RMS current and saturation current must not be exceeded**
  I_L_Max = sqrt( Iout_Max^2 + 1/12 * ( (Vout*(Vin_Max-Vout)) /			     		  		 (Vin_Max*Lo*f_sw*0.8) )^2 )
  5micro, 20V, 22V -> 3.017A
  5micro, 5V, 22V -> 3.079A
  11micro, 20V, 22V -> 3.0037A
  11micro, 5V, 22V -> 3.01669A
  I_L_Peak = Iout_Max + (Vout*(Vin_Max - Vout))  / (1.6*Vin_Max*Lo*f_sw)
  5micro, 20V, 22V -> 3.585A
  5micro, 5V, 22V ->  4.286A
  11micro, 20V, 22V -> 3.262A
  11micro, 5V, 22V -> 3.553A
  (Larger value inductors have lower AC current and result in lower output voltage ripple)
  -> Result: Choose around 11uH inductor rated for >4A peak current and >3.5A continuous current
  8.2.3.5.2 Output Capacitor Selection
  Consider three primary factors when selecting the value of the output capacitor. The output capacitor determines the modulator pole, the output voltage ripple, and how the regulator responds to a large change in load current. The output capacitance must be selected based on the more stringent of these three criteria
  Cout effects maximum instantaneos load change (ie 0->3A)  Eqn. (11)
  Cout effects voltage ripple at output Eqn. (12)
  Cout effects crossover frequency Eqn. (14)
  Maximum capacitor current Eqn. (15)
  *Feed forward capacitor can be added to feedback pin to improve phase margin Eqn. (16)

### Library data of the parts
C15 C19 = CMP-2006-03061-2: CAP CER 0.1UF 50V X7R 0603; Manufacturer: KEMET; Manufacturer Part Number: C0603C104K5RACTU; Tolerance: 0.1; Temperature Coefficient: 30ppm/°C; Material: Ceramic; Automotive Grade: Grade 1; Value: 0.10 μF; Temperature: -55°C to +125°C; RoHS: TRUE; Temperature Range High: +125°C; Lead Free: Yes; Octopart: https://octopart.com/c0603c104k5ractu-kemet-139244; Digikey Description: CAP CER 0.1UF 50V X7R 0603; Category: Cap; Package: C0603C-CF; ComponentLink2Description: Datasheet; Temperature Range Low: -55°C; Device Class L1: Passive Components; Voltage Rating: 50 V; Automotive: Yes; Device Class L3: Ceramic Capacitors; ComponentLink2URL: https://api.kemet.com/component-edge/download/datasheet/C0603C100J5GACAUTO.pdf; Capacitance: 0.10 μF; Device Class L2: Capacitors; Temperature Characteristic: X7R; Height: 0.87mm
C16 C17 = CMP-13271-000012-2: Ceramic Capacitor, Multilayer, Ceramic, 25V, 10% +Tol, 10% -Tol, X5R, 15% TC, 22uF, Surface Mount, 1206; Capacitance: 22µF; Material: Ceramic; RoHS: Compliant; Dielectric: X5R; HelpURL: https://product.samsungsem.com/mlcc/CL31A226KAHNNN.do; Max Operating Temperature: 85°C; Tolerance: 10%; Voltage Rating (DC): 25V; ComponentLink2Description: Datasheet URL; Voltage Rating: 25V; Min Operating Temperature: -55°C; ComponentLink2URL: https://product.samsungsem.com/mlcc/CL31A226KAHNNN.do; Case/Package: 1206; Height: 1.8mm
C18 = CMP-13271-000016-1: CAP CER 10UF 50V X5R 1206; Manufacturer: Samsung; Manufacturer Part Number: CL31A106KBHNNNE; Tolerance: 10%; Material: Ceramic; Temperature Coefficient: 15%; RoHS: TRUE; Ipc Land Pattern Name: CAPC320160X160; Temperature Range Low: -55°C; Value: 10uF; Device Class L3: Ceramic Capacitors; Category: Cap; Temperature Characteristic: X5R; Lead Free: Yes; Device Class L2: Capacitors; Octopart: https://octopart.com/cl31a106kbhnnne-samsung-19832778; ComponentLink2Description: Datasheet; Digikey Description: CAP CER 10UF 50V X5R 1206; Voltage: 50V; ComponentLink2URL: http://www.samsungsem.com/kr/support/product-search/mlcc/__icsFiles/afieldfile/2018/06/21/CL31A106KBHNNNE.pdf; Capacitance: 10uF; Temperature Range High: +85°C; Device Class L1: Passive Components; Height: 1.8mm; Automotive: No; Voltage Rating: 50V; Package: CL31; Temperature: -55°C to +85°C
C20 = CMP-2006-04358-1: Part Number: 06035A750JAT2A; Manufacturer: AVX Interconnect / Elco
L1 = CMP-07248-000069-1: FIXED IND 10UH 10A 16.5 MOHM SMD; Shielding: Shielded; Self Resonant Frequency: 10MHz; Test Frequency: 100kHz; Q Factor: 20; Saturation Current: 15.5A; Tolerance: 20%; Core Material: Carbonyl Powder; DC Resistance (DCR): 16.5mR; REACH SVHC: No SVHC; Case/Package: Nonstandard; Length: 13.5mm; RMS Current (Irms): 10A; Termination: SMD/SMT; Max DC Current: 10A; Ratings: AEC-Q200; Max Operating Temperature: 150°C; Height: 6.2mm; Resistor Type: Wirewound; Min Operating Temperature: -40°C; Mount: Surface Mount; Packaging: Cut Tape; Depth: 12.5mm; Package Quantity: 500; RoHS Compliant: Yes; Current Rating: 10A; Inductance Tolerance: 20%; Width: 0.492inch; Height - Seated (Max): 0.252inch; Inductance: 10uH
R23 = CMP-1012-00736-1: as R1 on sheet USBC_PD_Controller; Power: 0.1 W; Tolerance: 1 %; Technology: SMT
R24 = CMP-03412-006483-2: as R12 on sheet MCU; Case/Package: 0603; RoHS Compliant: Yes
R27 = CMP-00621-87214386-1: Fixed Resistor, Thin Film, 0.1W, 500ohm, 75V, 0.1% +/-Tol, 15ppm/Cel, Surface Mount, 0603; Temperature Coefficient: 15ppm/°C; Power Rating: 100mW; Resistance: 500Ω; ComponentLink1URL: http://www.yageo.com/; Min Operating Temperature: -55°C; ComponentLink1Description: Manufacturer URL; Tolerance: 0.1%; ComponentLink3URL: http://www.yageo.com/exep/pages/download/literatures/PYu-R_Mount_10.pdf; RoHS: Non-Compliant; Voltage Rating: 75V; Max Operating Temperature: 155°C; Height: 550µm; ComponentLink2URL: https://www.yageo.com/upload/media/product/productsearch/datasheet/rchip/PYu-RT_1-to-0.01_RoHS_L_15.pdf; Case/Package: 0603; Packaging: Tape & Reel; ComponentLink3Description: Package URL; Composition: Thin Film; ComponentLink2Description: Datasheet URL
U3 = CMP-04918-000032-1: IC REG BUCK ADJ 3A TSOT23-6; Manufacturer: Texas Instruments; Output Voltage: 0.6-26V; Output Type: AdjustableProgrammable; Max Junction Temp: +125°C; Number Of Outputs: 1; Min Supply Voltage: 4.5V; Switching Frequency: 400kHz; Standoff Height: 0mm; Max Duty Cycle: 100%; Nominal Supply Current: 45uA; Max Supply Voltage: 28V; Temperature Range High: +125°C; Switching Topology: Buck; Device Class L2: Power Management ICs; Output Current: 3A; Automotive: No; Temperature Range Low: -40°C; Temperature: -40°C to +125°C; Height: 1.1mm; Ipc Land Pattern Name: SOT95P280X110-6; RoHS: TRUE; Digikey Description: IC REG BUCK ADJ 3A TSOT23-6; Manufacturer Part Number: TPS54302DDCR; ComponentLink2Description: Datasheet; Device Class L3: Voltage Regulators - Switching; Octopart: https://octopart.com/tps54302ddcr-texas+instruments-74209025; Device Class L1: Integrated Circuits (ICs); Lead Free: Yes; ComponentLink2URL: http://www.ti.com/lit/ds/symlink/tps54302.pdf; Category: IC; Package: DDC0006A
U4 = CMP-09083-000073-1: IC DGT POT 50KOHM 256TAP SOT23-8; Operating Supply Voltage: 5.5V; Supply Current: 3uA; Memory Type: Volatile; Number of Elements: 1; Resistance: 50kR; Number of Taps: 256; Temperature Coefficient: 35ppm/°C; Resistance Tolerance: 30%; Min Supply Voltage: 2.7V; -3db Bandwidth: 1.2MHz; Interface: I2C; Frequency: 400kHz; Max Supply Voltage: 5.5V; Number of Pins: 8; Package Quantity: 3000; Case/Package: SOT-23; REACH SVHC: No SVHC; Number of Circuits: 1; Taper: Linear; Contact Plating: Gold; Min Operating Temperature: -40°C; Operating Supply Current: 3uA; RoHS Compliant: Yes; Packaging: Tape and Reel; Number of Positions: 256; Lead Free: Contains Lead; Max Supply Current: 3uA; Max Operating Temperature: 125°C; Nominal Supply Current: 3uA; Radiation Hardening: No; Mount: Surface Mount; Tolerance: 30%; Series: -; Quiescent Current: 3uA

## Sheet Negative_Output.SchDoc
size A; SheetNumber: 5; SheetTotal: 8
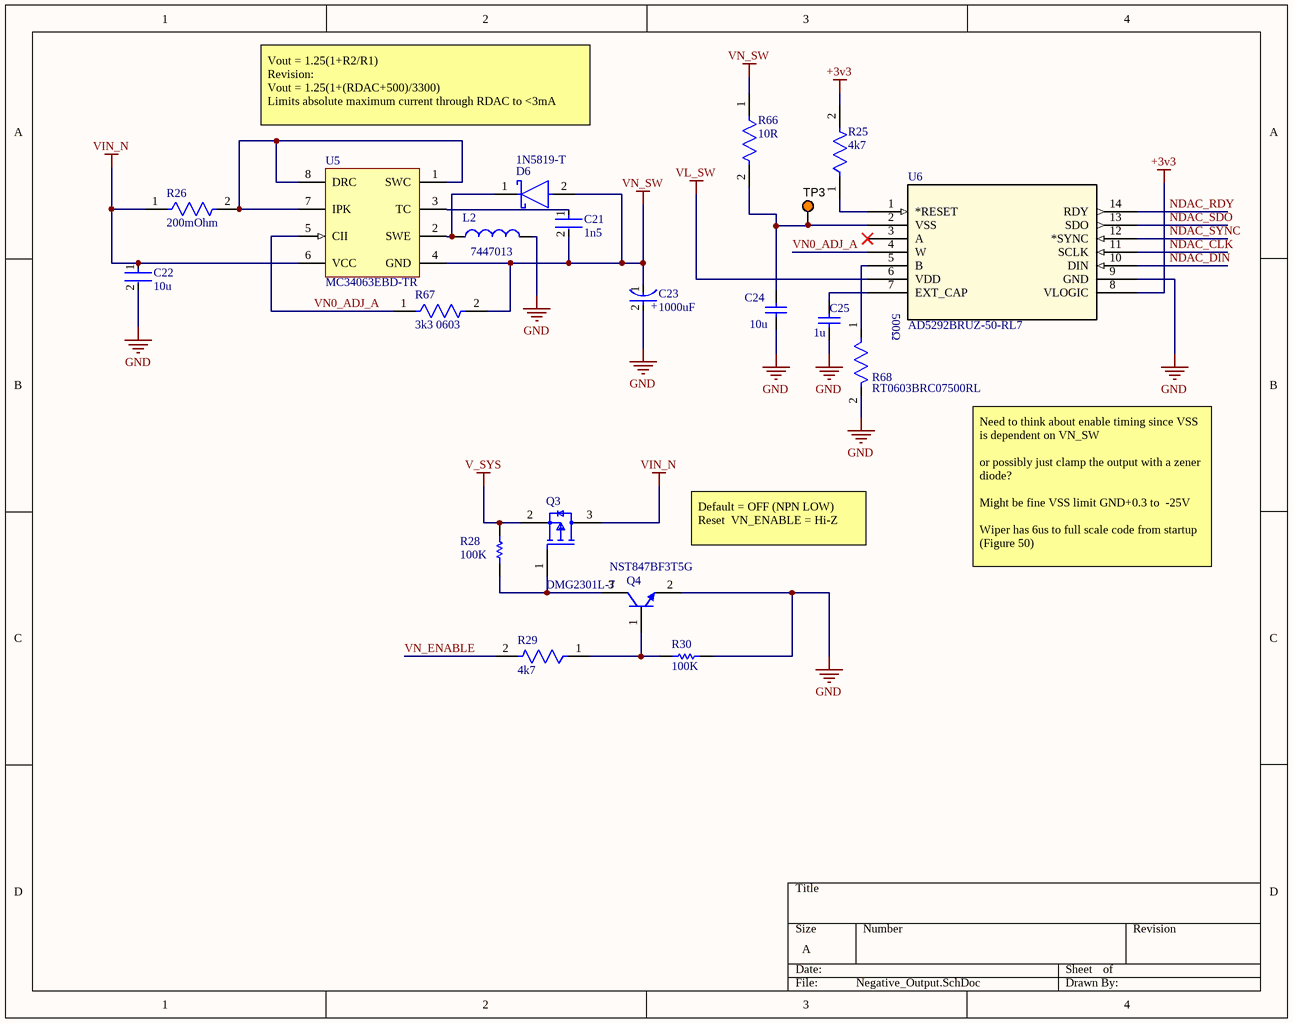
[diagram p4: Negative_Output.SchDoc]

### Parts
C21  1n5  [FP-C0603C-CF-MFG]
C22  10u  [FP-C0805X106K8RACAUTO-MFG]
C23  1000uF  [FP-FTG-MFG]
C24  10u  [CAPC2013X145X50NL20T25]
C25  1u  [CAPC2013X145X50NL20T25]
D6  1N5819-T  [FP-DO-41_Plastic-MFG]
L2  7447013  [7447013]
Q3  DMG2301L-7  [FP-SOT23-MFG]
Q4  NST847BF3T5G  [ONSC-SOT-1123-3-524AA_V]
R25  4k7  [FP-AC0603-IPC_A]
R26  200mOhm  [FP-CSR0603-IPC_A]
R28  100K  [RESC0603(1608)_N]
R29  4k7  [FP-AC0603-IPC_A]
R30  100K  [RESC0603(1608)_N]
R66  10R  [FP-SR0603-MFG]
R67  3k3 0603  [FP-AC0603-IPC_C]
R68  RT0603BRC07500RL  [RESC16080X45_RT0603-0_55_MFG]
TP3  5003  [KSTN-5003]  (value not drawn)
U5  MC34063EBD-TR  [SO8_M]
U6  AD5292BRUZ-50-RL7  [RU-14_ADI]

### Nets
+3v3: R25.2 U6.8(VLOGIC)
GND: C22.2 C23.2(A) C24.1 C25.1 L2.2 Q4.2(E) R30.1 R68.2 U6.9(GND)
V_SYS: Q3.2(S) R28.2
VIN_N: C22.1 Q3.3(D) R26.1 U5.6(VCC)
VL_SW: U6.6(VDD)
VN_SW: C21.2 C23.1(C) D6.2(A) R66.1 R67.2 U5.4(GND)  [project net RS+]
NDAC_CLK: U6.11(SCLK)
NDAC_DIN: U6.10(DIN)
NDAC_RDY: U6.14(RDY)
NDAC_SDO: U6.13(SDO)
NDAC_SYNC: U6.12(*SYNC)
VN0_ADJ_A: R67.1 U5.5(CII) U6.4(W)
VN_ENABLE: R29.2
NetC21_1: C21.1 U5.3(TC)
NetC24_2: C24.2 R66.2 TP3.1 U6.2(VSS)
NetC25_2: C25.2 U6.7(EXT_CAP)
NetD6_1: D6.1(C) L2.1 U5.2(SWE)
NetQ3_1: Q3.1(G) Q4.3(C) R28.1
NetQ4_1: Q4.1(B) R29.1 R30.2
NetR25_1: R25.1 U6.1(*RESET)
NetR26_2: R26.2 U5.1(SWC) U5.7(IPK) U5.8(DRC)
NetR68_1: R68.1 U6.5(B)

Not connected (* = marked no-connect by the designer): U6 3(A)*

### Notes on the sheet
- Vout = 1.25(1+R2/R1)
  Revision:
  Vout = 1.25(1+(RDAC+500)/3300)
  Limits absolute maximum current through RDAC to <3mA
- Default = OFF (NPN LOW)
  Reset  VN_ENABLE = Hi-Z
- Need to think about enable timing since VSS is dependent on VN_SW
  or possibly just clamp the output with a zener diode?
  Might be fine VSS limit GND+0.3 to  -25V
  Wiper has 6us to full scale code from startup
  (Figure 50)
- (in symbol CMP-05427-000029-1) +

### Library data of the parts
C21 = CMP-03020-017874-1: C0603 1,500 pF X7R 30ppm/°C 5.00% 50 V; Manufacturer Part Number: C0603C152J5RACAUTO; Manufacturer: KEMET; Tolerance: 0.05; Material: Ceramic; Voltage Rating: 50 V; Automotive Grade: Grade 1; Temperature Coefficient: 30ppm/°C; Lead Free: Yes; Automotive: Yes; Capacitance: 1,500 pF; Height: 0.87mm; Octopart: https://octopart.com/c0603c152j5racauto-kemet-48652793; Package: C0603C-CF; Device Class L1: Passive Components; RoHS: TRUE; Temperature Range Low: -55°C; ComponentLink2URL: https://api.kemet.com/component-edge/download/datasheet/C0603C100J5GACAUTO.pdf; ComponentLink2Description: Datasheet; Device Class L2: Capacitors; Device Class L3: Ceramic Capacitors; Category: Cap; Temperature: -55°C to +125°C; Temperature Range High: +125°C; Temperature Characteristic: X7R; Value: 1,500 pF
C22 = CMP-03020-034694-1: CAP CER 10UF 10V X7R 0805; Tolerance: 10%; Case/Package: 0805; Min Operating Temperature: -55°C; Max Operating Temperature: 125°C; RoHS Compliant: Yes; Ratings: AEC-Q200; Mount: Surface Mount; Features: Soft Termination; Capacitance: 10uF; Packaging: Cut Tape; Case Code (Metric): 2012; Voltage Rating: 10V; Case Code (Imperial): 0805
C23 = CMP-05427-000029-1: CAP ALUM 1000UF 20% 25V SMD
C24 C25 = CMP-2007-01213-1: as C6 on sheet MCU
D6 = CMP-12790-000042-1: DIODE SCHOTTKY 40V 1A DO41; Manufacturer: Diodes Inc.; Max Surge Forward Current: 25A; Capacitance: 110 pF; Max Junction Temp: +125°C; Peak Reverse Current: 1mA; Value: 110 pF; Temperature Range Low: -65°C; Footprint Url: https://www.diodes.com/assets/Package-Files/DO-41-Plastic.pdf; Digikey Description: DIODE SCHOTTKY 40V 1A DO41; Category: Diode; Mouser Description: Schottky Diodes & Rectifiers Vr/40V Io/1A T/R; Device Class L2: Diodes; Temperature Range High: +125°C; RoHS: TRUE; Device Class L3: Schottky Diodes; ComponentLink2Description: Datasheet; Temperature: -65°C to +125°C; Reverse Voltage: 40V; Height: 2.72mm; ComponentLink2URL: https://www.diodes.com/assets/Datasheets/ds23001.pdf; Forward Current: 1A; Manufacturer Part Number: 1N5819-T; Lead Free: Yes; Device Class L1: Discrete Semiconductors; Max Repetitive Reverse Voltage: 40V; Ipc Land Pattern Name: DIOPA1091W105L521D272; Automotive: No; Package: DO-41 (Plastic); Octopart: https://octopart.com/1n5819-t-diodes+inc.-55389586
L2 = CMP-03913-130924366-2: Toroidal Inductors, 90Uh, 0.04 Ohm, 4.6A Rohs Compliant: Yes; Inductance: 90µH; Pin Length: 15mm; RoHS: Compliant; Max Operating Temperature: 105°C; Width: 10.5mm; Length: 18.5mm; Ambient Temperature Range High: 65°C; Min Operating Temperature: -40°C; Ambient Temperature Range Low: -40°C; Current Rating: 4.6A
Q3 = CMP-12801-000065-1: MOSFET P-CH 20V 3A SOT23; Manufacturer: Diodes Inc.; Number Of Channels: 1; Turn On Delay Time: 5ns; Drain To Source Resistance: 120mΩ; Max Junction Temp: +150°C; Gate To Source Voltage: 8V; Power Dissipation: 1.5W; Rthja Max: 83°C/W; Max Forward Diode Voltage: -1.2V; Standoff Height: 0.013mm; Threshold Vgs Min: -0.4V; Input Capacitace At Vds: 476pF @ -10V; Depletion Mode: False; Gate Charge At Vgs: 5.5nC @ -4.5V; Pulse Drain Current: -10A; Drain To Source Voltage: -20V; Continuous Drain Current: -3A; Turn Off Delay Time: 30ns; Lead Free: Yes; Package: SOT23; ComponentLink2Description: Datasheet; Device Class L3: MOSFETs; Device Class L1: Discrete Semiconductors; Manufacturer Part Number: DMG2301L-7; Automotive: No; Height: 1.1mm; Category: Trans; Temperature Range High: +150°C; Digikey Description: MOSFET P-CH 20V 3A SOT23; RoHS: TRUE; Number Of P Channels: 1; Footprint Url: https://www.diodes.com/assets/Package-Files/SOT23.pdf; Octopart: https://octopart.com/dmg2301l-7-diodes+inc.-67250456; ComponentLink2URL: https://www.diodes.com/assets/Datasheets/DMG2301L.pdf; Mouser Description: Single P-Channel 20 V 1.5 W 5.5 nC Silicon Surface Mount Mosfet - SOT-23; Drain To Source Breakdown Voltage: -20V; Threshold Vgs Max: -1.2V; Device Class L2: Transistors; Temperature: -55°C to +150°C; Temperature Range Low: -55°C
Q4 = CMP-1048-00443-1: NPN General Purpose Transistor, 3-Pin SOT-1123, Pb-Free, Tape and Reel; Manufacturer: On Semiconductor; fT Min (MHz): 100; IC Continuous (A): 0.1; RoHS: TRUE; PartNumber: NST847BF3T5G; Packing: Tape and Reel; ComponentLink3Description: Package Specification; ComponentLink2URL: http://www.onsemi.com/pub_link/Collateral/NST847BF3-D.PDF; PackageReference: SOT-1123-3-524AA; PackageDescription: 3-Pin Small Outline Transistor, Body 0.8 x 0.6 mm, Pitch 0.375 mm; PackageVersion: Rev. C, 11/2011; ComponentLink1Description: Manufacturer URL; Mounting Technology: Surface Mount; ComponentLink2Description: Datasheet; ComponentLink1URL: http://www.onsemi.com/; DatasheetVersion: Rev. 1; Polarity: NPN; ComponentLink3URL: http://www.onsemi.cn/pub_link/Collateral/524AA.PDF
R25 R29 = CMP-03412-006483-2: as R12 on sheet MCU; Case/Package: 0603; RoHS Compliant: Yes
R26 = CMP-26527-003125-1: General Purpose Thick Film Chip Resistor, 0603, 0.2Ω, 1%, 300ppm/°C, 0.125W; Max Power Dissipation: 125mW; Resistance: 200mR; Resistor Type: Thick Film; Max Operating Temperature: 155°C; Radiation Hardening: No; Length: 0.063inch; Case Code (Metric): 1608; RoHS Compliant: Yes; Case Code (Imperial): 0603; Lead Free: Lead Free; Width: 0.031inch; Number of Terminations: 2; Series: CSR; Height: 0.022inch; Case/Package: 0603; Packaging: Tape and Reel; Mount: Surface Mount; Min Operating Temperature: -55°C; Temperature Coefficient: 300ppm/°C; Contact Plating: Tin; Tolerance: 1%
R28 R30 = CMP-1012-00736-1: as R1 on sheet USBC_PD_Controller; Power: 0.1 W; Tolerance: 1 %; Technology: SMT
R66 = CMP-03412-016018-1: RES SMD 0603 1/4W 1% 10 OHM; Manufacturer Part Number: SR0603FR-7T10RL; Manufacturer: Yageo; Voltage Rating: 75V; Value: 10Ω; Tolerance: 0.01; Automotive Grade: Grade 0; Power Rating: 0.25W; Footprint Url: http://www.yageo.com/exep/pages/download/literatures/PYu-R_Mount_10.pdf; Digikey Description: RES SMD 0603 1/4W 1% 10 OHM; Device Class L2: Resistors; Octopart: https://octopart.com/sr0603fr-7t10rl-yageo-91478074; Temperature Range Low: -55°C; Device Class L3: Chip SMD Resistors; ComponentLink2Description: Datasheet; Height: 0.55mm; Automotive: Yes; Lead Free: Yes; Category: Res; Resistance: 10Ω; RoHS: TRUE; Series: SR; Temperature: -55°C to +155°C; Device Class L1: Passive Components; Temperature Range High: +155°C; Composition: Thick Film; Package: SR0603; ComponentLink2URL: http://www.yageo.com/documents/recent/PYu-SR_D_F%20tol_RoHS_L_3.pdf; Ipc Land Pattern Name: RESC16080X45
R67 = CMP-03412-041670-1: RES 3.3kΩ 1.00% 0.2W 0603; RoHS Compliant: Yes
R68 = CMP-00621-87214386-1: as R27 on sheet Positive_Output; ComponentLink1URL: http://www.yageo.com/; Min Operating Temperature: -55°C; ComponentLink1Description: Manufacturer URL; Tolerance: 0.1%; ComponentLink3URL: http://www.yageo.com/exep/pages/download/literatures/PYu-R_Mount_10.pdf; RoHS: Non-Compliant; Voltage Rating: 75V; Max Operating Temperature: 155°C; Height: 550µm; ComponentLink2URL: https://www.yageo.com/upload/media/product/productsearch/datasheet/rchip/PYu-RT_1-to-0.01_RoHS_L_15.pdf; Case/Package: 0603; Packaging: Tape & Reel; ComponentLink3Description: Package URL; Composition: Thin Film; ComponentLink2Description: Datasheet URL
TP3 = CMP-1672-00009-1: as TP1 on sheet USBC_PD_Controller; Max Operating Temperature: 150 degC; PackageReference: 5003; Pins: 2; ComponentLink2URL: http://keyelco.com/userAssets/file/M65p56.pdf; PackageDescription: 1-Pin Through Hole Device, Dia 2.54 mm; Weight: 0.01 lb; Diameter: 5.3 mm; Mount: Through Hole; Package Quantity: 500; Packaging: Bulk; Min Operating Temperature: -65 degC; ComponentLink1Description: Manufacturer URL; Height: 0.25 inch; ComponentLink1URL: http://www.keyelco.com/; ComponentLink2Description: Datasheet; Width: 0.25 inch; REACH SVHC: No SVHC; RoHSCompliant: true; Radiation Hardening: No; Length: 9.5 mm; DatasheetVersion: Jun-15
U5 = CMP-0241-00013-1: DC/DC converter control circuit, 8-Pin SO, Tape and Reel; ComponentLink2URL: http://www.st.com/internet/com/TECHNICAL_RESOURCES/TECHNICAL_LITERATURE/DATASHEET/CD00001232.pdf; ComponentLink1URL: http://www.st.com; PackageVersion: Dec-2002; Code_IPC: SOIC127P600-8; PackageDescription: 8-Pin Small Outline Integrated Circuit 1.27 mm Pitch; DatasheetVersion: Nov-2007; PackageReference: SO8; ComponentLink2Description: Datasheet; ComponentLink3Description: Package Specification; ComponentLink1Description: Manufacturer URL; Code_JEDEC: MS-012-AA; ComponentLink3URL: http://www.st.com/internet/com/TECHNICAL_RESOURCES/TECHNICAL_LITERATURE/PACKAGE_INFORMATION/CD00004680.pdf
U6 = AD5292BRUZ-50-RL7: 256-/1024-Position, Digital Potentiometers with Maximum Â±1% R-Tolerance Error and 20-TP Memory; Manufacturer_Name: Analog Devices Inc; Type: Data Acquisition; Copyright: Copyright (C) 2026 Ultra Librarian. All rights reserved.; Manufacturer_Part_Number: AD5292BRUZ-50-RL7; Datasheet: https://www.analog.com/media/en/technical-documentation/data-sheets/AD5291_5292.pdf; RefDes: RefDes